# Altium schematic sheet MB_main.SchDoc
size 594 x 420 mm; SheetNumber: 1; SheetTotal: 7
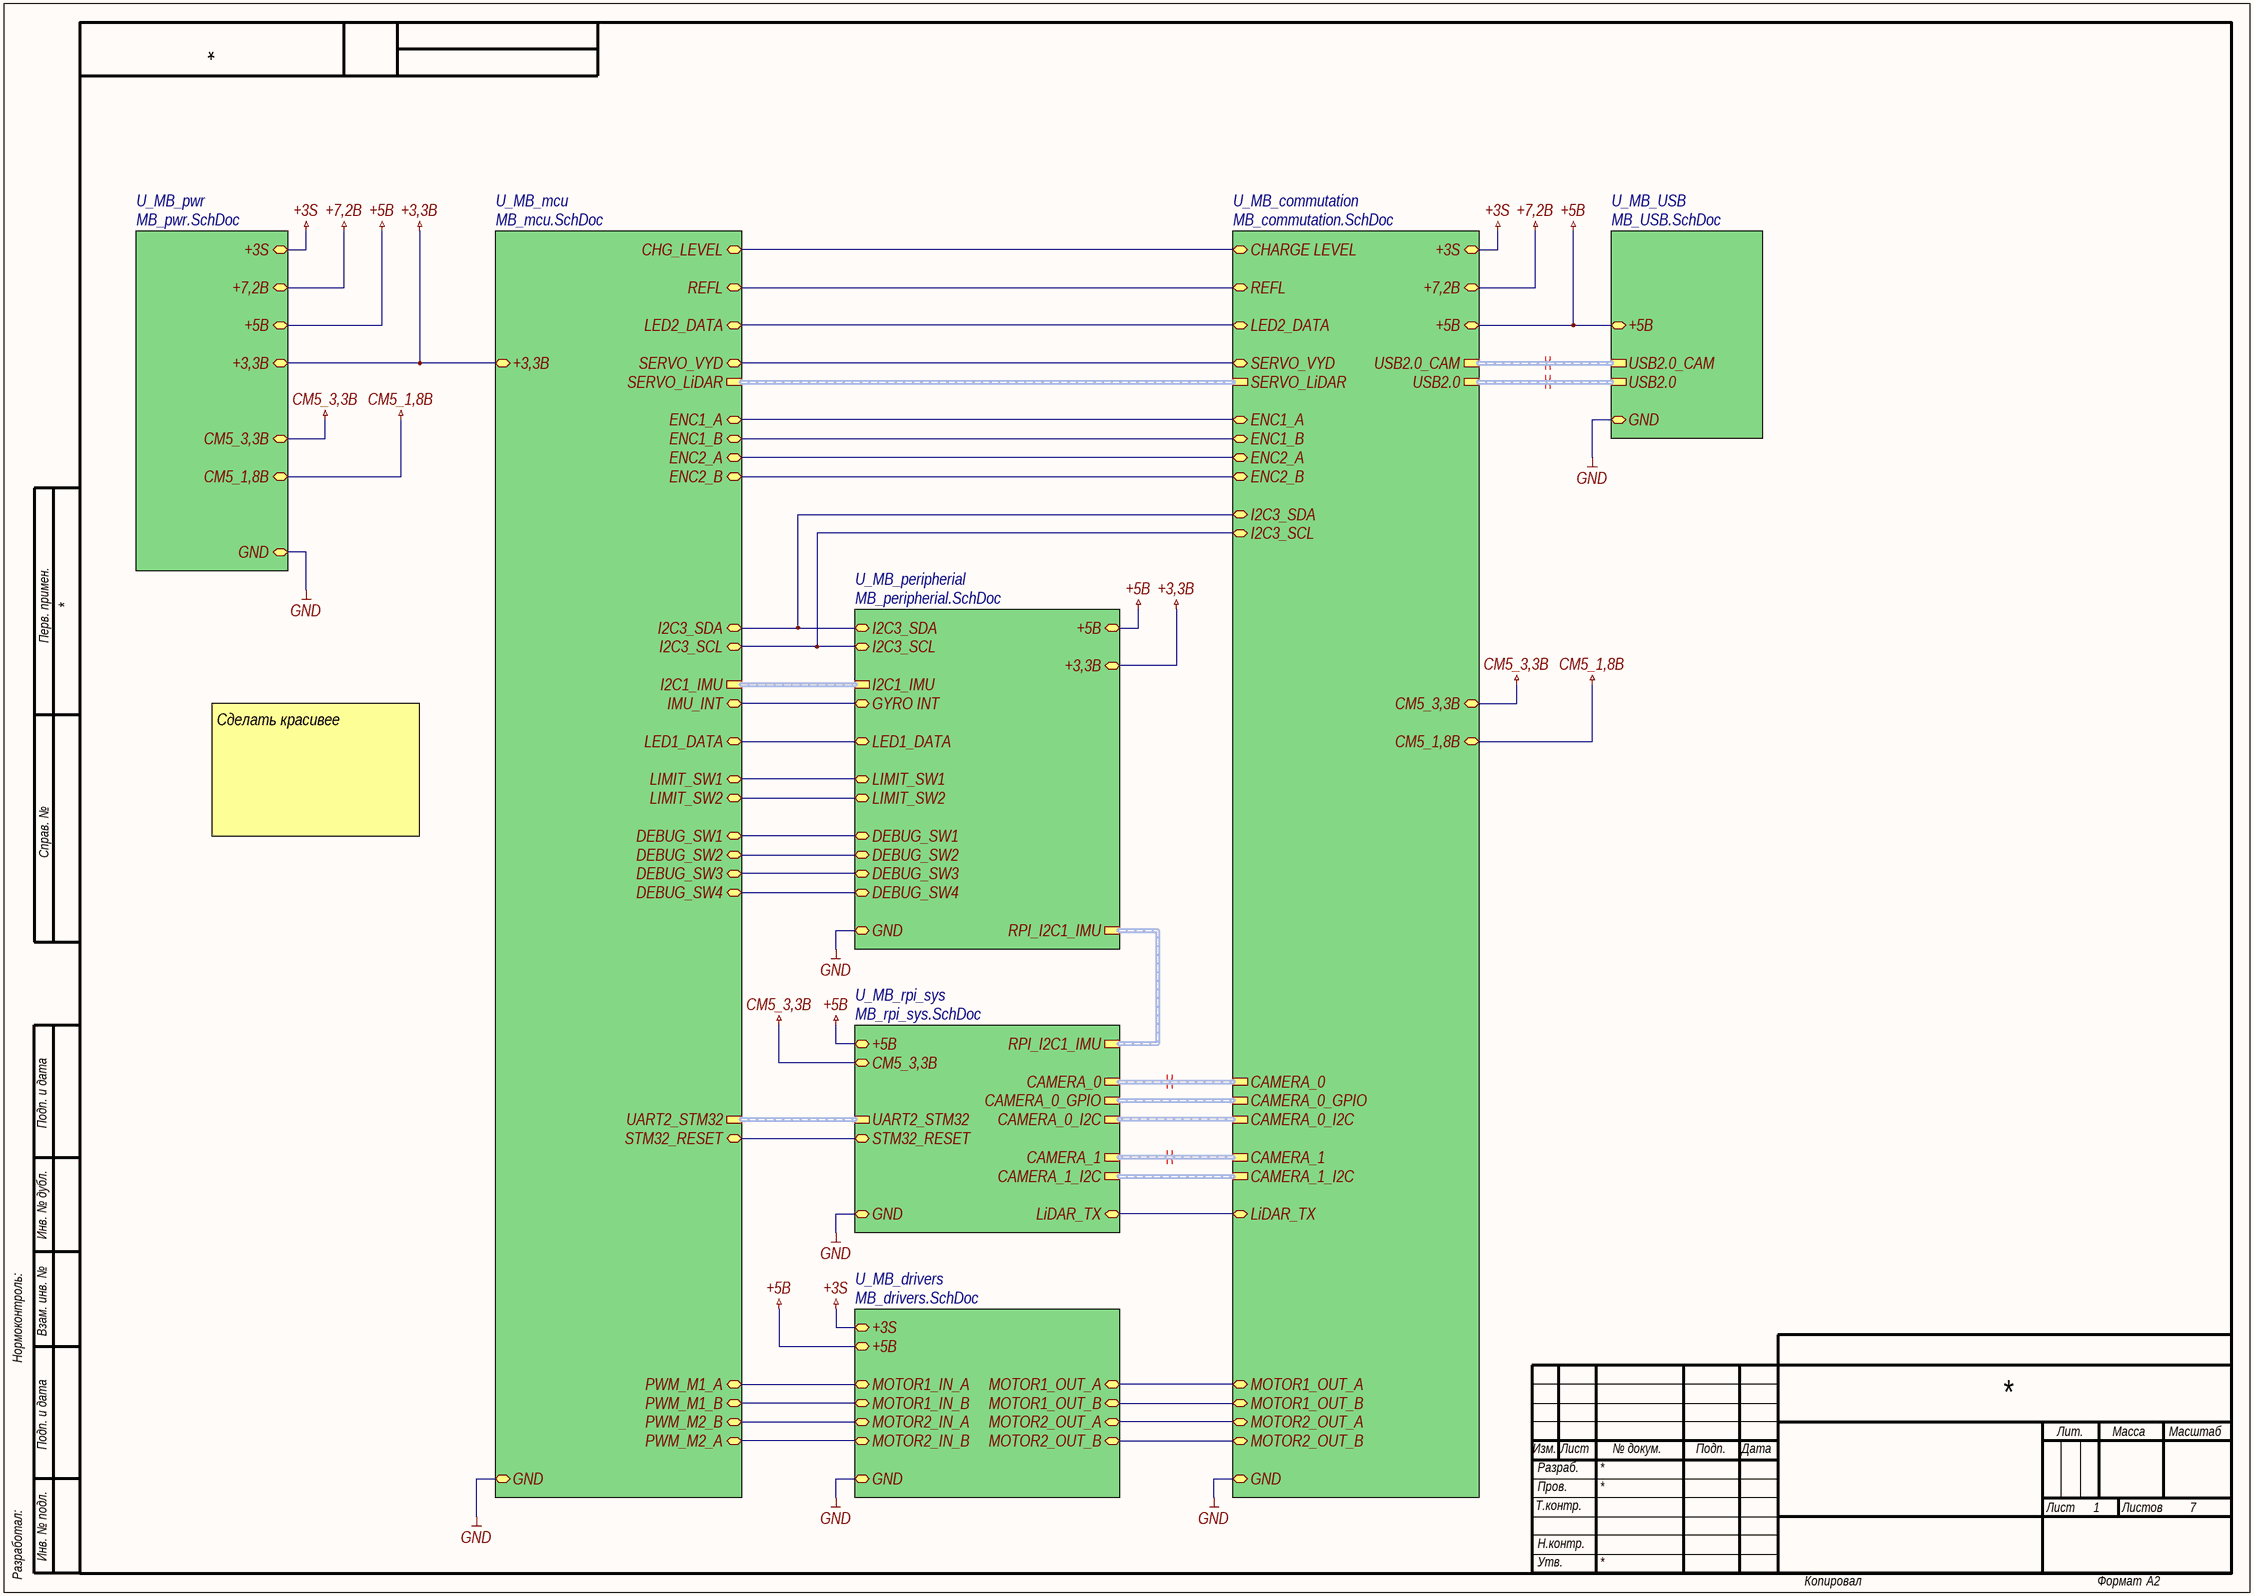
[diagram p0: MB_main.SchDoc]

## Sub-sheets
U_MB_commutation = MB_commutation.SchDoc: +5В (bidir), GND (bidir), +3S (bidir), LED2_DATA (bidir), LiDAR_TX (bidir), CHARGE LEVEL (bidir), I2C3_SCL (bidir), I2C3_SDA (bidir), MOTOR2_OUT_B (bidir), MOTOR2_OUT_A (bidir), MOTOR1_OUT_A (bidir), MOTOR1_OUT_B (bidir), ENC1_A (bidir), ENC1_B (bidir), ENC2_A (bidir), ENC2_B (bidir), CAMERA_1 (harness MIPI CSI1), CAMERA_0 (harness MIPI CSI0), SERVO_LiDAR (harness IMU  LiDAR STB), CM5_3,3В (bidir), CM5_1,8В (bidir), SERVO_VYD (bidir), REFL (bidir), CAMERA_0_GPIO (harness CSI0_GPIO), CAMERA_0_I2C (harness CSI0_I2C), CAMERA_1_I2C (harness CSI1_I2C), +7,2В (bidir), USB2.0_CAM (harness USB2.0_CAM), USB2.0 (harness USB2.0)
U_MB_drivers = MB_drivers.SchDoc: MOTOR2_OUT_B (bidir), MOTOR2_OUT_A (bidir), MOTOR2_IN_A (bidir), MOTOR2_IN_B (bidir), MOTOR1_OUT_A (bidir), MOTOR1_OUT_B (bidir), MOTOR1_IN_A (bidir), MOTOR1_IN_B (bidir), +5В (bidir), GND (bidir), +3S (bidir)
U_MB_mcu = MB_mcu.SchDoc: +3,3В (bidir), GND (bidir), I2C3_SDA (bidir), I2C3_SCL (bidir), SERVO_VYD (bidir), PWM_M1_B (bidir), PWM_M2_B (bidir), PWM_M2_A (bidir), ENC1_A (bidir), ENC1_B (bidir), ENC2_B (bidir), LED1_DATA (bidir), LED2_DATA (bidir), LIMIT_SW1 (bidir), LIMIT_SW2 (bidir), DEBUG_SW1 (bidir), DEBUG_SW2 (bidir), DEBUG_SW3 (bidir), I2C1_IMU (harness IMU I2C), REFL (bidir), DEBUG_SW4 (bidir), SERVO_LiDAR (harness IMU  LiDAR STB), ENC2_A (bidir), PWM_M1_A (bidir), IMU_INT (bidir), CHG_LEVEL (bidir), STM32_RESET (bidir), UART2_STM32 (harness USART)
U_MB_peripherial = MB_peripherial.SchDoc: LED1_DATA (bidir), I2C3_SCL (bidir), I2C3_SDA (bidir), I2C1_IMU (harness IMU I2C), +3,3В (bidir), GND (bidir), +5В (bidir), GYRO INT (bidir), LIMIT_SW1 (bidir), LIMIT_SW2 (bidir), DEBUG_SW1 (bidir), DEBUG_SW2 (bidir), DEBUG_SW3 (bidir), DEBUG_SW4 (bidir), RPI_I2C1_IMU (harness IMU)
U_MB_pwr = MB_pwr.SchDoc: +3,3В (bidir), GND (bidir), +5В (bidir), +7,2В (bidir), +3S (bidir), CM5_3,3В (bidir), CM5_1,8В (bidir)
U_MB_rpi_sys = MB_rpi_sys.SchDoc: +5В (bidir), GND (bidir), LiDAR_TX (bidir), CAMERA_1 (harness MIPI CSI1), CAMERA_0 (harness MIPI CSI0), CM5_3,3В (bidir), CAMERA_0_GPIO (harness CSI0_GPIO), CAMERA_0_I2C (harness CSI0_I2C), CAMERA_1_I2C (harness CSI1_I2C), STM32_RESET (bidir), UART2_STM32 (harness USART), RPI_I2C1_IMU (harness IMU)
U_MB_USB = MB_USB.SchDoc: +5В (bidir), GND (bidir), USB2.0_CAM (harness USB2.0_CAM), USB2.0 (harness USB2.0)

## Nets
+3,3В: sheet U_MB_pwr/+3,3В, sheet U_MB_mcu/+3,3В, sheet U_MB_peripherial/+3,3В
+3S: sheet U_MB_pwr/+3S, sheet U_MB_drivers/+3S, sheet U_MB_commutation/+3S
+5В: sheet U_MB_pwr/+5В, sheet U_MB_USB/+5В, sheet U_MB_rpi_sys/+5В, sheet U_MB_peripherial/+5В, sheet U_MB_drivers/+5В, sheet U_MB_commutation/+5В
+7,2В: sheet U_MB_pwr/+7,2В, sheet U_MB_commutation/+7,2В
CM5_1,8В: sheet U_MB_pwr/CM5_1,8В, sheet U_MB_commutation/CM5_1,8В
CM5_3,3В: sheet U_MB_pwr/CM5_3,3В, sheet U_MB_rpi_sys/CM5_3,3В, sheet U_MB_commutation/CM5_3,3В
GND: sheet U_MB_pwr/GND, sheet U_MB_mcu/GND, sheet U_MB_USB/GND, sheet U_MB_rpi_sys/GND, sheet U_MB_peripherial/GND, sheet U_MB_drivers/GND, sheet U_MB_commutation/GND
(unnamed): sheet U_MB_mcu/I2C3_SDA, sheet U_MB_peripherial/I2C3_SDA, sheet U_MB_commutation/I2C3_SDA
(unnamed): sheet U_MB_mcu/I2C3_SCL, sheet U_MB_peripherial/I2C3_SCL, sheet U_MB_commutation/I2C3_SCL
(unnamed): sheet U_MB_mcu/SERVO_VYD, sheet U_MB_commutation/SERVO_VYD
(unnamed): sheet U_MB_mcu/PWM_M1_B, sheet U_MB_drivers/MOTOR1_IN_B
(unnamed): sheet U_MB_mcu/PWM_M2_B, sheet U_MB_drivers/MOTOR2_IN_A
(unnamed): sheet U_MB_mcu/PWM_M2_A, sheet U_MB_drivers/MOTOR2_IN_B
(unnamed): sheet U_MB_mcu/ENC1_A, sheet U_MB_commutation/ENC1_A
(unnamed): sheet U_MB_mcu/ENC1_B, sheet U_MB_commutation/ENC1_B
(unnamed): sheet U_MB_mcu/ENC2_B, sheet U_MB_commutation/ENC2_B
(unnamed): sheet U_MB_mcu/LED1_DATA, sheet U_MB_peripherial/LED1_DATA
(unnamed): sheet U_MB_mcu/LED2_DATA, sheet U_MB_commutation/LED2_DATA
(unnamed): sheet U_MB_mcu/LIMIT_SW1, sheet U_MB_peripherial/LIMIT_SW1
(unnamed): sheet U_MB_mcu/LIMIT_SW2, sheet U_MB_peripherial/LIMIT_SW2
(unnamed): sheet U_MB_mcu/DEBUG_SW1, sheet U_MB_peripherial/DEBUG_SW1
(unnamed): sheet U_MB_mcu/DEBUG_SW2, sheet U_MB_peripherial/DEBUG_SW2
(unnamed): sheet U_MB_mcu/DEBUG_SW3, sheet U_MB_peripherial/DEBUG_SW3
(unnamed): sheet U_MB_mcu/REFL, sheet U_MB_commutation/REFL
(unnamed): sheet U_MB_mcu/DEBUG_SW4, sheet U_MB_peripherial/DEBUG_SW4
(unnamed): sheet U_MB_mcu/ENC2_A, sheet U_MB_commutation/ENC2_A
(unnamed): sheet U_MB_mcu/PWM_M1_A, sheet U_MB_drivers/MOTOR1_IN_A
(unnamed): sheet U_MB_mcu/IMU_INT, sheet U_MB_peripherial/GYRO INT
(unnamed): sheet U_MB_mcu/CHG_LEVEL, sheet U_MB_commutation/CHARGE LEVEL
(unnamed): sheet U_MB_mcu/STM32_RESET, sheet U_MB_rpi_sys/STM32_RESET
(unnamed): sheet U_MB_rpi_sys/LiDAR_TX, sheet U_MB_commutation/LiDAR_TX
(unnamed): sheet U_MB_drivers/MOTOR2_OUT_B, sheet U_MB_commutation/MOTOR2_OUT_B
(unnamed): sheet U_MB_drivers/MOTOR2_OUT_A, sheet U_MB_commutation/MOTOR2_OUT_A
(unnamed): sheet U_MB_drivers/MOTOR1_OUT_A, sheet U_MB_commutation/MOTOR1_OUT_A
(unnamed): sheet U_MB_drivers/MOTOR1_OUT_B, sheet U_MB_commutation/MOTOR1_OUT_B

## Buses and harness runs
harness sheet U_MB_commutation/CAMERA_0 = sheet U_MB_rpi_sys/CAMERA_0
harness sheet U_MB_commutation/CAMERA_0_GPIO = sheet U_MB_rpi_sys/CAMERA_0_GPIO
harness sheet U_MB_commutation/CAMERA_0_I2C = sheet U_MB_rpi_sys/CAMERA_0_I2C
harness sheet U_MB_commutation/CAMERA_1 = sheet U_MB_rpi_sys/CAMERA_1
harness sheet U_MB_commutation/CAMERA_1_I2C = sheet U_MB_rpi_sys/CAMERA_1_I2C
harness sheet U_MB_commutation/SERVO_LiDAR = sheet U_MB_mcu/SERVO_LiDAR
harness sheet U_MB_commutation/USB2.0 = sheet U_MB_USB/USB2.0
harness sheet U_MB_commutation/USB2.0_CAM = sheet U_MB_USB/USB2.0_CAM
harness sheet U_MB_mcu/I2C1_IMU = sheet U_MB_peripherial/I2C1_IMU
harness sheet U_MB_mcu/UART2_STM32 = sheet U_MB_rpi_sys/UART2_STM32
harness sheet U_MB_peripherial/RPI_I2C1_IMU = sheet U_MB_rpi_sys/RPI_I2C1_IMU

## Layout directives
differential pair; rule Differential Pairs Routing [Pref Gap = 0.3mm    Min Gap  = 0.3mm    Max Gap  = 0.3mmPref Width = 0.184mm    Min Width  = 0.184mm    Max Width  = 0.184mm]; rule Matched Net Lengths [Tolerance = 1.5mm]; rule Matched Net Lengths [Tolerance = 0.15mm]; differential pair class CAM_0; net class CAM_0: (no net found under the mark)
differential pair; rule Differential Pairs Routing [Pref Gap = 0.3mm    Min Gap  = 0.3mm    Max Gap  = 0.3mmPref Width = 0.184mm    Min Width  = 0.184mm    Max Width  = 0.184mm]; rule Matched Net Lengths [Tolerance = 1.5mm]; rule Matched Net Lengths [Tolerance = 0.15mm]; differential pair class CAM_1; net class CAM_1: (no net found under the mark)
differential pair; rule Differential Pairs Routing [Pref Gap = 0.3mm    Min Gap  = 0.3mm    Max Gap  = 0.3mmPref Width = 0.184mm    Min Width  = 0.184mm    Max Width  = 0.184mm]; rule Matched Net Lengths [Tolerance = 1.5mm]; rule Matched Net Lengths [Tolerance = 0.15mm]; differential pair class USB_2.0; net class USB_2.0: (no net found under the mark)
differential pair; rule Differential Pairs Routing [Pref Gap = 0.3mm    Min Gap  = 0.3mm    Max Gap  = 0.3mmPref Width = 0.184mm    Min Width  = 0.184mm    Max Width  = 0.184mm]; rule Matched Net Lengths [Tolerance = 1.5mm]; rule Matched Net Lengths [Tolerance = 0.15mm]; differential pair class USB_2.0_CAM; net class USB_2.0_CAM: (no net found under the mark)

## Notes on the sheet
- Сделать красивее
- Перв. примен.
- Справ. №
- Подп. и дата
- Инв. № дубл.
- Нормоконтроль:
- Взам. инв. №
- Изм.
- Лист
- № докум.
- Подп.
- Дата
- Лит.
- Масса
- Масштаб
- Т.контр.
- Пров.
- Разраб.
- Листов
- Разработал:
- Инв. № подл.
- Н.контр.
- Утв.
- Копировал
- Формат
- А2